# Altium schematic sheet User Interface.SchDoc
size A
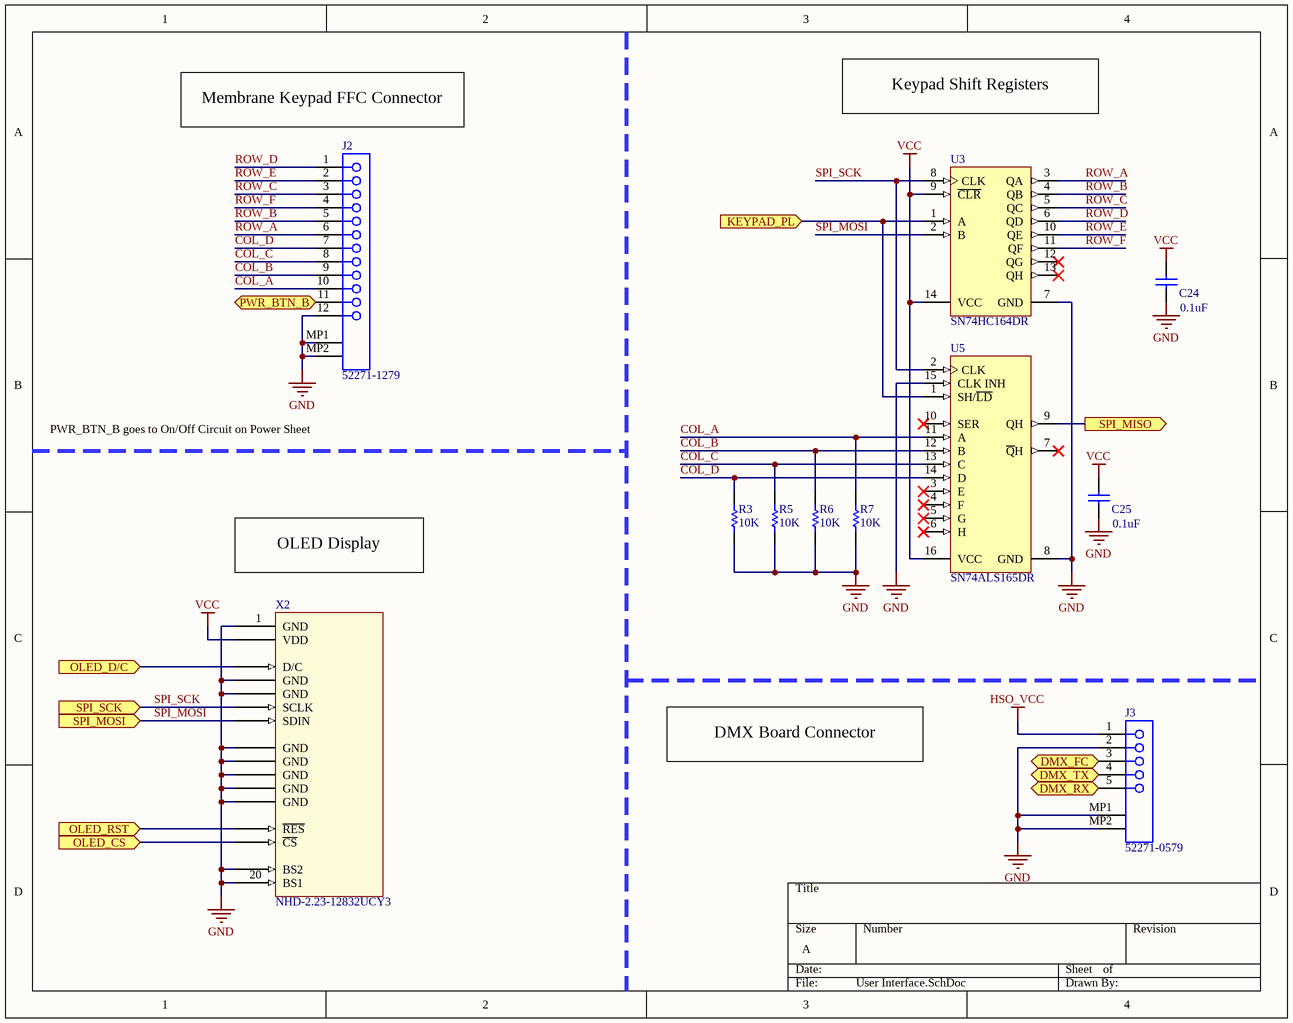
[diagram p0: User Interface.SchDoc]

## Parts
C24  0.1uF  [CAPC0603(1608)100_L]
C25  0.1uF  [CAPC0603(1608)100_L]
J2  52271-1279  [MOLX-52271-1279]
J3  52271-0579  [MOLX-52271-0579]
R3  10K  [RESC0603(1608)_N]
R5  10K  [RESC0603(1608)_N]
R6  10K  [RESC0603(1608)_N]
R7  10K  [RESC0603(1608)_N]
U3  SN74HC164DR  [D0014A_M]
U5  SN74ALS165DR  [D0016A_L]
X2  NHD-2.23-12832UCY3  [NHD-2.23-12832UCY3]

## Ports
DMX_FC (in), DMX_RX (out), DMX_TX (in), KEYPAD_PL (in), OLED_CS (in), OLED_D/C (in), OLED_RST (in), PWR_BTN_B (bidir), SPI_MISO (out), SPI_MOSI (in), SPI_SCK (in)

## Nets
GND: C24.1 C25.1 J2.12 J2.MP1 J2.MP2 J3.2 J3.MP1 J3.MP2 R3.1 R5.1 R6.1 R7.1 U3.7(GND) U5.8(GND) U5.15(CLK_INH) X2.1(GND) X2.5(GND) X2.6(GND) X2.10(GND) X2.11(GND) X2.12(GND) X2.13(GND) X2.14(GND) X2.19(BS2) X2.20(BS1)
HSO_VCC: J3.1
VCC: C24.2 C25.2 U3.9(~{CLR}) U3.14(VCC) U5.16(VCC) X2.2(VDD)
COL_A: J2.10 R7.2 U5.11(A)
COL_B: J2.9 R6.2 U5.12(B)
COL_C: J2.8 R5.2 U5.13(C)
COL_D: J2.7 R3.2 U5.14(D)
DMX_FC: J3.3 ; port DMX_FC
DMX_RX: J3.5 ; port DMX_RX
DMX_TX: J3.4 ; port DMX_TX
KEYPAD_PL: U3.1(A) U5.1(SH/~{LD}) ; port KEYPAD_PL
OLED_CS: X2.17(~{CS}) ; port OLED_CS
OLED_D/C: X2.4(D/C) ; port OLED_D/C
OLED_RST: X2.16(~{RES}) ; port OLED_RST
PWR_BTN_B: J2.11 ; port PWR_BTN_B
ROW_A: J2.6 U3.3(QA)
ROW_B: J2.5 U3.4(QB)
ROW_C: J2.3 U3.5(QC)
ROW_D: J2.1 U3.6(QD)
ROW_E: J2.2 U3.10(QE)
ROW_F: J2.4 U3.11(QF)
SPI_MISO: U5.9(QH) ; port SPI_MISO
SPI_MOSI: U3.2(B) X2.8(SDIN) ; port SPI_MOSI
SPI_SCK: U3.8(CLK) U5.2(CLK) X2.7(SCLK) ; port SPI_SCK

Not connected (* = marked no-connect by the designer): U3 12(QG)* 13(QH)*; U5 3(E)* 4(F)* 5(G)* 6(H)* 7(~{Q}H)* 10(SER)*; X2 3(NC) 9(NC) 15(NC) 18(NC)

## Notes on the sheet
- (near J2) Membrane Keypad FFC Connector
- Keypad Shift Registers
- PWR_BTN_B goes to On/Off Circuit on Power Sheet
- OLED Display
- DMX Board Connector

## Library data of the parts
C24 C25 = CMP-1035-00873-1: CAP 27pF 16V ±0.5pF 0603 (1608 Metric) Thickness 1mm SMD; Tolerance: Â±0.5pF; Case-Metric: 1608; Case-EIA: 0603; Value: 27pF; Max Thickness: 1 mm; Rated Voltage: 16 V; Technology: SMT
J2 = 52271-1279: 1.0 mm Pitch Easy-On(TM) Type FPC Connector, 3.0 mm Mated Height, Right Angle, ZIF, SMT, Bottom Contact, 12 Circuits, -40 to 85 degC, ELV and RoHS Compliant, Tape and Reel; Manufacturer: Molex; Circuits (Loaded): 12; Current (Max per Contact): 0.5A; Durability (mating cycles max): 30; Entry Angle: 90degrees Angle; Mated Height: 3.00mm; Material - Metal: Phosphor Bronze; Material - Plating Mating: Tin-Bismuth; PCB Locator: No; PCB Retention: Yes; Pitch - Mating Interface: 1.00mm; Voltage (Max): 50V AC (RMS)/DC; PackageVersion: Rev. B, 04/2004; PackageReference: 52271-1279; PackageDescription: 12-Lead FPC Connector, Pitch 1.0 mm; Supplier 1: Farnell; Supplier Part Number 1: 1079952; Supplier 2: Newark; Supplier Part Number 2: 72M5544; Supplier 3: Mouser; Supplier Part Number 3: 538-52271-1279; Contact Position: Bottom; Material - Plating Termination: Tin-Bismuth; Number of Rows: 1; Orientation: Right Angle; Packing: Tape and Reel; Pitch - Termination Interface: 1.00mm; Polarized to PCB: Yes; RoHS: TRUE; Stackable: No; Mounting Technology: Surface Mount; PartNumber: 52271-1279; ComponentLink1Description: Manufacturer URL; ComponentLink1URL: http://www.molex.com/molex/index.jsp; ComponentLink2Description: Datasheet; ComponentLink2URL: http://www.molex.com/webdocs/datasheets/pdf/en-us/0522711279_FFC_FPC_CONNECTORS.pdf; ComponentLink3Description: Package Specification; ComponentLink3URL: http://www.molex.com/pdm_docs/sd/522711279_sd.pdf
J3 = 52271-0579: 1.0 mm Pitch Easy-On(TM) Type FPC Connector, 3.0 mm Mated Height, Right Angle, ZIF, SMT, Bottom Contact, 5 Circuits, -40 to 85 degC, ELV and RoHS Compliant, Tape and Reel; Manufacturer: Molex; Circuits (Loaded): 5; Current (Max per Contact): 0.5A; Durability (mating cycles max): 30; Entry Angle: 90degrees Angle; Mated Height: 3.00mm; Material - Metal: Phosphor Bronze; Material - Plating Mating: Tin-Bismuth; PCB Locator: No; PCB Retention: Yes; Pitch - Mating Interface: 1.00mm; Voltage (Max): 50V AC (RMS)/DC; PackageVersion: Rev. B, 04/2004; PackageReference: 52271-0579; PackageDescription: 5-Lead FPC Connector, Pitch 1.0 mm; Supplier 1: Mouser; Supplier Part Number 1: 538-52271-0579; Contact Position: Bottom; Material - Plating Termination: Tin-Bismuth; Number of Rows: 1; Orientation: Right Angle; Packing: Tape and Reel; Pitch - Termination Interface: 1.00mm; Polarized to PCB: Yes; RoHS: TRUE; Stackable: No; Mounting Technology: Surface Mount; PartNumber: 52271-0579; ComponentLink1Description: Manufacturer URL; ComponentLink1URL: http://www.molex.com/molex/index.jsp; ComponentLink2Description: Datasheet; ComponentLink2URL: http://www.molex.com/webdocs/datasheets/pdf/en-us/0522710579_FFC_FPC_CONNECTORS.pdf; ComponentLink3Description: Package Specification; ComponentLink3URL: http://www.molex.com/pdm_docs/sd/522710579_sd.pdf
R3 R5-R7 = CMP-1012-00001-1: Jumper 0603 (1608 Metric); Case-Metric: 1608; Value: 0.00 Ohm; Power: None; Case-EIA: 0603; Technology: SMT; Tolerance: None
U3 = CMP-0780-00006-3: 8-Bit Parallel-Out Serial Shift Registers, D0014A, LARGE T&R; Manufacturer: Texas Instruments; 3-State Output: No; F @ Nom Voltage(Max)(Mhz): 28; Bits: 8; Output Type: CMOS; VCC(Max)(V): 6; Technology Family: HC; VCC(Min)(V): 2; tpd @ Nom Voltage(Max)(ns): 38; ICC @ Nom Voltage(Max)(mA): 0.08; Rating: Catalog; Output Drive (IOL/IOH)(Max)(mA): 5.2/-5.2; PackageVersion: http://www.ti.com/lit/ml/mpds177g/mpds177g.pdf; Voltage(Nom)(V): 6; Code_JEDEC: MS-012; DatasheetVersion: SCLS115F; Generic Part Number: SN74HC164; Operating Temperature Range(C): -40 to 125; Input Type: CMOS; PackageReference: D0014A
U5 = CMP-0780-00014-3: Parallel-Load 8-Bit Serial Shift Registers, D0016A, LARGE T&R; Manufacturer: Texas Instruments; VCC(Min)(V): 4.5; Output Type: TTL; Bits: 8; ICC @ Nom Voltage(Max)(mA): 24; F @ Nom Voltage(Max)(Mhz): 75; tpd @ Nom Voltage(Max)(ns): 14; 3-State Output: No; Technology Family: ALS; Voltage(Nom)(V): 5; Output Drive (IOL/IOH)(Max)(mA): 8/-0.4; VCC(Max)(V): 5.5; Rating: Catalog; Operating Temperature Range(C): 0 to 70; DatasheetVersion: SDAS157B; Generic Part Number: SN74ALS165; Input Type: TTL; PackageVersion: http://www.ti.com/lit/ml/mpds178g/mpds178g.pdf; Code_JEDEC: MS-012 variation AC; PackageReference: D0016A